# EasyEDA Pro project ProDoc_P1_2024-12-10.epro

# Schematic Schematic1
Board Name: 铝基灯板; Create Date: 2024-11-29; Page Name: P1; Project Name: 手电筒; Schematic Name: Schematic1; Update Date: 2024-11-30; Company: 嘉立创EDA; Page Size: A4; Version: V1.0
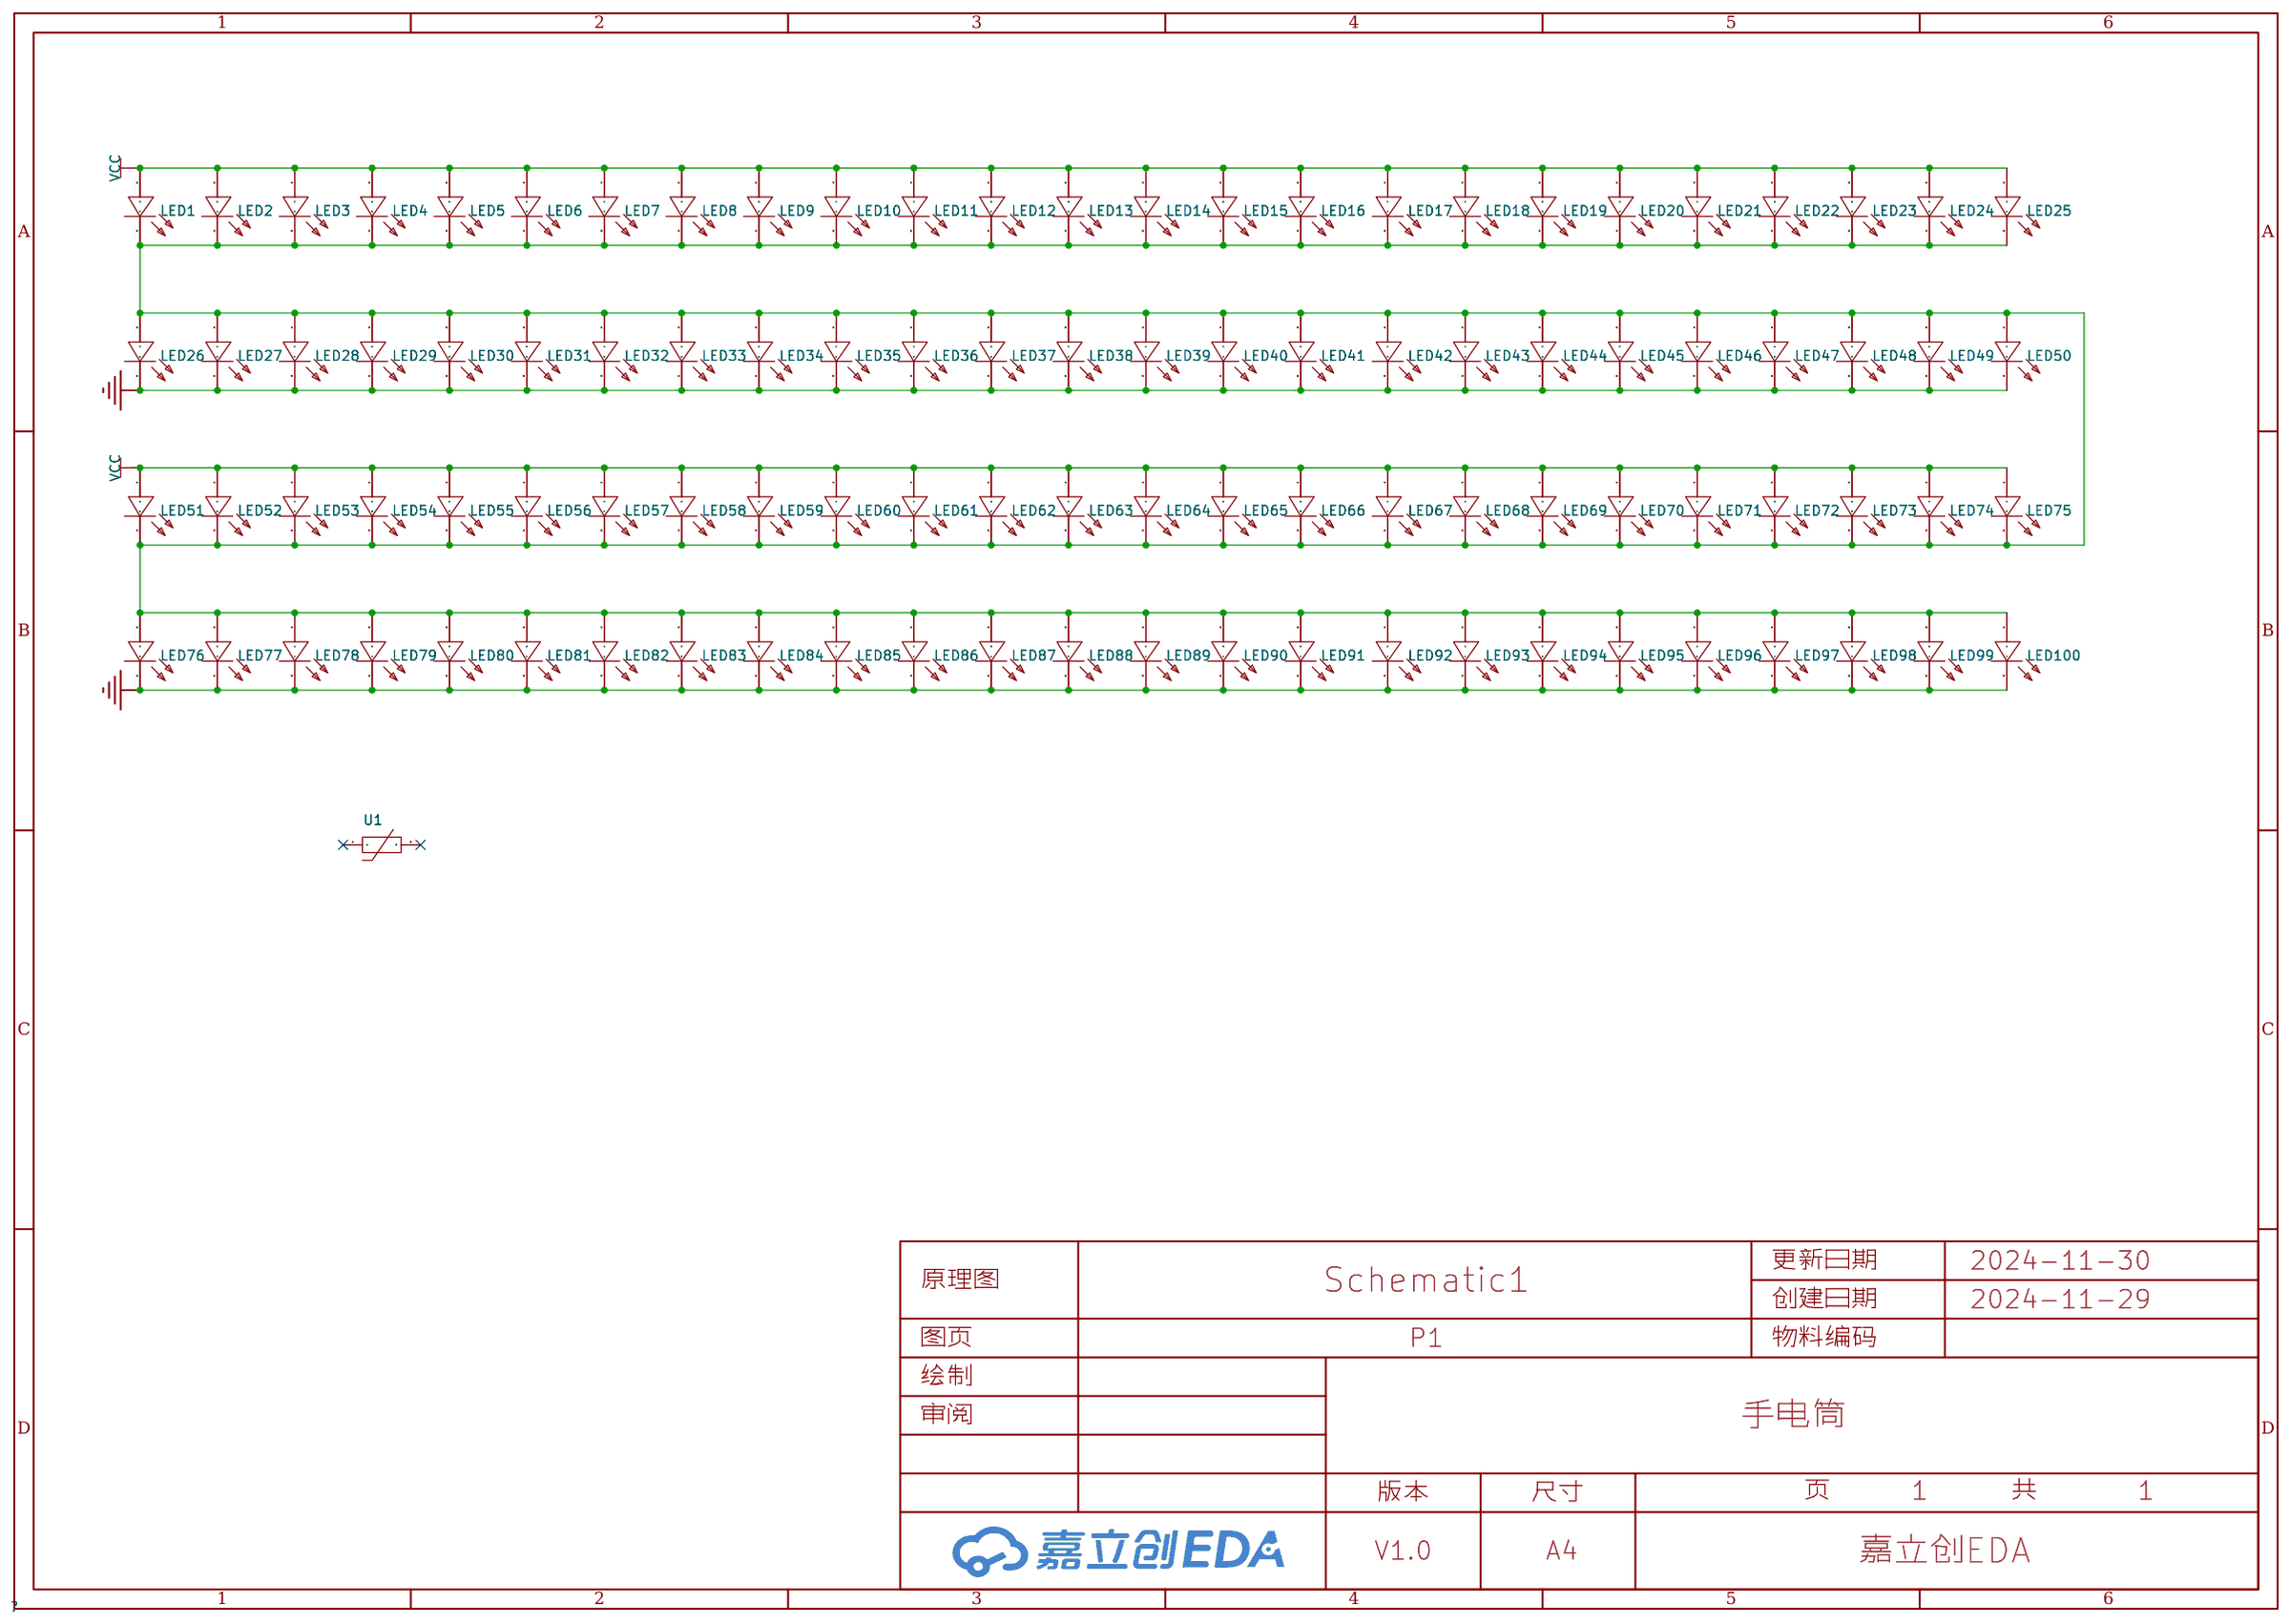
[diagram p0: schematic sheet]

## Parts
LED1  SAW9L60A  [emc5050-1]
LED2  SAW9L60A  [emc5050-1]
LED3  SAW9L60A  [emc5050-1]
LED4  SAW9L60A  [emc5050-1]
LED5  SAW9L60A  [emc5050-1]
LED6  SAW9L60A  [emc5050-1]
LED7  SAW9L60A  [emc5050-1]
LED8  SAW9L60A  [emc5050-1]
LED9  SAW9L60A  [emc5050-1]
LED10  SAW9L60A  [emc5050-1]
LED11  SAW9L60A  [emc5050-1]
LED12  SAW9L60A  [emc5050-1]
LED13  SAW9L60A  [emc5050-1]
LED14  SAW9L60A  [emc5050-1]
LED15  SAW9L60A  [emc5050-1]
LED16  SAW9L60A  [emc5050-1]
LED17  SAW9L60A  [emc5050-1]
LED18  SAW9L60A  [emc5050-1]
LED19  SAW9L60A  [emc5050-1]
LED20  SAW9L60A  [emc5050-1]
LED21  SAW9L60A  [emc5050-1]
LED22  SAW9L60A  [emc5050-1]
LED23  SAW9L60A  [emc5050-1]
LED24  SAW9L60A  [emc5050-1]
LED25  SAW9L60A  [emc5050-1]
LED26  SAW9L60A  [emc5050-1]
LED27  SAW9L60A  [emc5050-1]
LED28  SAW9L60A  [emc5050-1]
LED29  SAW9L60A  [emc5050-1]
LED30  SAW9L60A  [emc5050-1]
LED31  SAW9L60A  [emc5050-1]
LED32  SAW9L60A  [emc5050-1]
LED33  SAW9L60A  [emc5050-1]
LED34  SAW9L60A  [emc5050-1]
LED35  SAW9L60A  [emc5050-1]
LED36  SAW9L60A  [emc5050-1]
LED37  SAW9L60A  [emc5050-1]
LED38  SAW9L60A  [emc5050-1]
LED39  SAW9L60A  [emc5050-1]
LED40  SAW9L60A  [emc5050-1]
LED41  SAW9L60A  [emc5050-1]
LED42  SAW9L60A  [emc5050-1]
LED43  SAW9L60A  [emc5050-1]
LED44  SAW9L60A  [emc5050-1]
LED45  SAW9L60A  [emc5050-1]
LED46  SAW9L60A  [emc5050-1]
LED47  SAW9L60A  [emc5050-1]
LED48  SAW9L60A  [emc5050-1]
LED49  SAW9L60A  [emc5050-1]
LED50  SAW9L60A  [emc5050-1]
LED51  SAW9L60A  [emc5050-1]
LED52  SAW9L60A  [emc5050-1]
LED53  SAW9L60A  [emc5050-1]
LED54  SAW9L60A  [emc5050-1]
LED55  SAW9L60A  [emc5050-1]
LED56  SAW9L60A  [emc5050-1]
LED57  SAW9L60A  [emc5050-1]
LED58  SAW9L60A  [emc5050-1]
LED59  SAW9L60A  [emc5050-1]
LED60  SAW9L60A  [emc5050-1]
LED61  SAW9L60A  [emc5050-1]
LED62  SAW9L60A  [emc5050-1]
LED63  SAW9L60A  [emc5050-1]
LED64  SAW9L60A  [emc5050-1]
LED65  SAW9L60A  [emc5050-1]
LED66  SAW9L60A  [emc5050-1]
LED67  SAW9L60A  [emc5050-1]
LED68  SAW9L60A  [emc5050-1]
LED69  SAW9L60A  [emc5050-1]
LED70  SAW9L60A  [emc5050-1]
LED71  SAW9L60A  [emc5050-1]
LED72  SAW9L60A  [emc5050-1]
LED73  SAW9L60A  [emc5050-1]
LED74  SAW9L60A  [emc5050-1]
LED75  SAW9L60A  [emc5050-1]
LED76  SAW9L60A  [emc5050-1]
LED77  SAW9L60A  [emc5050-1]
LED78  SAW9L60A  [emc5050-1]
LED79  SAW9L60A  [emc5050-1]
LED80  SAW9L60A  [emc5050-1]
LED81  SAW9L60A  [emc5050-1]
LED82  SAW9L60A  [emc5050-1]
LED83  SAW9L60A  [emc5050-1]
LED84  SAW9L60A  [emc5050-1]
LED85  SAW9L60A  [emc5050-1]
LED86  SAW9L60A  [emc5050-1]
LED87  SAW9L60A  [emc5050-1]
LED88  SAW9L60A  [emc5050-1]
LED89  SAW9L60A  [emc5050-1]
LED90  SAW9L60A  [emc5050-1]
LED91  SAW9L60A  [emc5050-1]
LED92  SAW9L60A  [emc5050-1]
LED93  SAW9L60A  [emc5050-1]
LED94  SAW9L60A  [emc5050-1]
LED95  SAW9L60A  [emc5050-1]
LED96  SAW9L60A  [emc5050-1]
LED97  SAW9L60A  [emc5050-1]
LED98  SAW9L60A  [emc5050-1]
LED99  SAW9L60A  [emc5050-1]
LED100  SAW9L60A  [emc5050-1]
U1  B57355V5104F360  [R0603]

## Library data of the parts
LED1-LED100 = KT-0805W: 色温6000K左右; LCSC Part Name: 0805 白灯 高亮; Supplier Part: C34499; Manufacturer: KENTO; Supplier Footprint: 0805; JLCPCB Part Class: 基础库; Datasheet: https://atta.szlcsc.com/upload/public/pdf/source/20221124/DAA20402FFC1FB071B8B6797757426FE.pdf; Supplier: LCSC
U1 = B57355V5104F360: 阻值(25℃):100kΩ;B值(25℃/50℃):4200K;电阻精度:±1%;功率:180mW;B值精度:±1%;; LCSC Part Name: 100kΩ 电阻精度:±1% 4200K; Supplier Part: C2962567; Manufacturer: TDK; Supplier Footprint: 0603; JLCPCB Part Class: 扩展库; Datasheet: https://atta.szlcsc.com/upload/public/pdf/source/20220905/434B6F7B3124D618F0519BEC712EC39F.pdf; Supplier: LCSC; Resistance @ 25℃: 100kΩ; B Constant (25℃/50℃): 4200K; Resistance Tolerance: ±1%; B Constant (25℃/85℃): 4260K; B Constant (25℃/100℃): 4282K; Power: 180mW; B Constant Tolerance: ±1%; Operating Temperature: -40℃~+150℃

## Nets
GND: LED26.2(K) LED27.2(K) LED28.2(K) LED29.2(K) LED30.2(K) LED31.2(K) LED32.2(K) LED33.2(K) LED34.2(K) LED35.2(K) LED36.2(K) LED37.2(K) LED38.2(K) LED39.2(K) LED40.2(K) LED41.2(K) LED42.2(K) LED43.2(K) LED44.2(K) LED45.2(K) LED46.2(K) LED47.2(K) LED48.2(K) LED49.2(K) LED50.2(K) LED76.2(K) LED77.2(K) LED78.2(K) LED79.2(K) LED80.2(K) LED81.2(K) LED82.2(K) LED83.2(K) LED84.2(K) LED85.2(K) LED86.2(K) LED87.2(K) LED88.2(K) LED89.2(K) LED90.2(K) LED91.2(K) LED92.2(K) LED93.2(K) LED94.2(K) LED95.2(K) LED96.2(K) LED97.2(K) LED98.2(K) LED99.2(K) LED100.2(K)
VCC: LED1.1(A) LED2.1(A) LED3.1(A) LED4.1(A) LED5.1(A) LED6.1(A) LED7.1(A) LED8.1(A) LED9.1(A) LED10.1(A) LED11.1(A) LED12.1(A) LED13.1(A) LED14.1(A) LED15.1(A) LED16.1(A) LED17.1(A) LED18.1(A) LED19.1(A) LED20.1(A) LED21.1(A) LED22.1(A) LED23.1(A) LED24.1(A) LED25.1(A) LED51.1(A) LED52.1(A) LED53.1(A) LED54.1(A) LED55.1(A) LED56.1(A) LED57.1(A) LED58.1(A) LED59.1(A) LED60.1(A) LED61.1(A) LED62.1(A) LED63.1(A) LED64.1(A) LED65.1(A) LED66.1(A) LED67.1(A) LED68.1(A) LED69.1(A) LED70.1(A) LED71.1(A) LED72.1(A) LED73.1(A) LED74.1(A) LED75.1(A)
Net-(LED1-2): LED1.2(K) LED2.2(K) LED3.2(K) LED4.2(K) LED5.2(K) LED6.2(K) LED7.2(K) LED8.2(K) LED9.2(K) LED10.2(K) LED11.2(K) LED12.2(K) LED13.2(K) LED14.2(K) LED15.2(K) LED16.2(K) LED17.2(K) LED18.2(K) LED19.2(K) LED20.2(K) LED21.2(K) LED22.2(K) LED23.2(K) LED24.2(K) LED25.2(K) LED26.1(A) LED27.1(A) LED28.1(A) LED29.1(A) LED30.1(A) LED31.1(A) LED32.1(A) LED33.1(A) LED34.1(A) LED35.1(A) LED36.1(A) LED37.1(A) LED38.1(A) LED39.1(A) LED40.1(A) LED41.1(A) LED42.1(A) LED43.1(A) LED44.1(A) LED45.1(A) LED46.1(A) LED47.1(A) LED48.1(A) LED49.1(A) LED50.1(A) LED51.2(K) LED52.2(K) LED53.2(K) LED54.2(K) LED55.2(K) LED56.2(K) LED57.2(K) LED58.2(K) LED59.2(K) LED60.2(K) LED61.2(K) LED62.2(K) LED63.2(K) LED64.2(K) LED65.2(K) LED66.2(K) LED67.2(K) LED68.2(K) LED69.2(K) LED70.2(K) LED71.2(K) LED72.2(K) LED73.2(K) LED74.2(K) LED75.2(K) LED76.1(A) LED77.1(A) LED78.1(A) LED79.1(A) LED80.1(A) LED81.1(A) LED82.1(A) LED83.1(A) LED84.1(A) LED85.1(A) LED86.1(A) LED87.1(A) LED88.1(A) LED89.1(A) LED90.1(A) LED91.1(A) LED92.1(A) LED93.1(A) LED94.1(A) LED95.1(A) LED96.1(A) LED97.1(A) LED98.1(A) LED99.1(A) LED100.1(A)

Not connected (* = marked no-connect by the designer): U1 1* 2*
